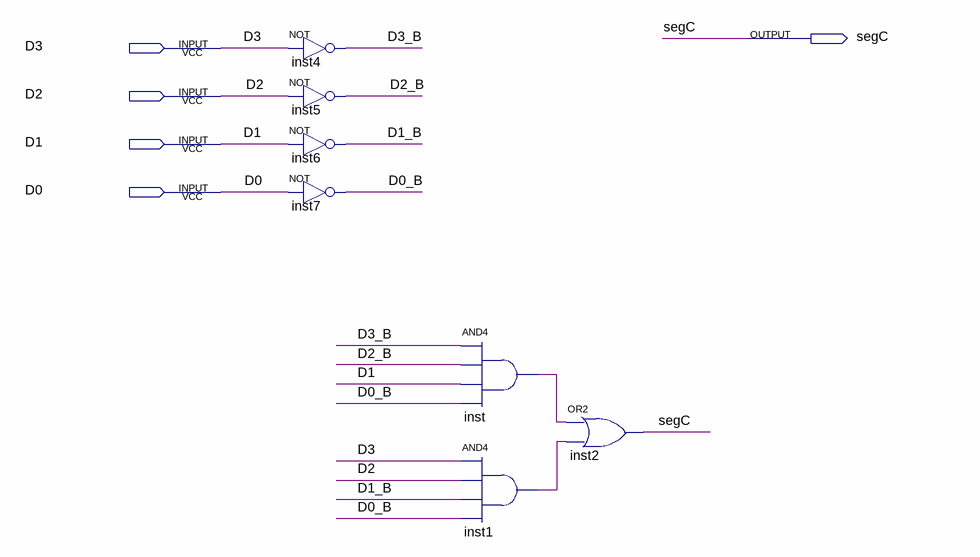
[diagram p0: schematic sheet]
// Quartus schematic segC.bdf as structural Verilog: 7 symbols, 5 pins
module segC (
  input  D3,
  input  D2,
  input  D1,
  input  D0,
  output segC
);

  wire D0_B, D1_B, D2_B, D3_B, inst1_out, inst_out;

  not inst4 (D3_B, D3);
  not inst5 (D2_B, D2);
  not inst6 (D1_B, D1);
  not inst7 (D0_B, D0);
  and inst (inst_out, D3_B, D2_B, D1, D0_B);
  and inst1 (inst1_out, D3, D2, D1_B, D0_B);
  or inst2 (segC, inst_out, inst1_out);
endmodule
